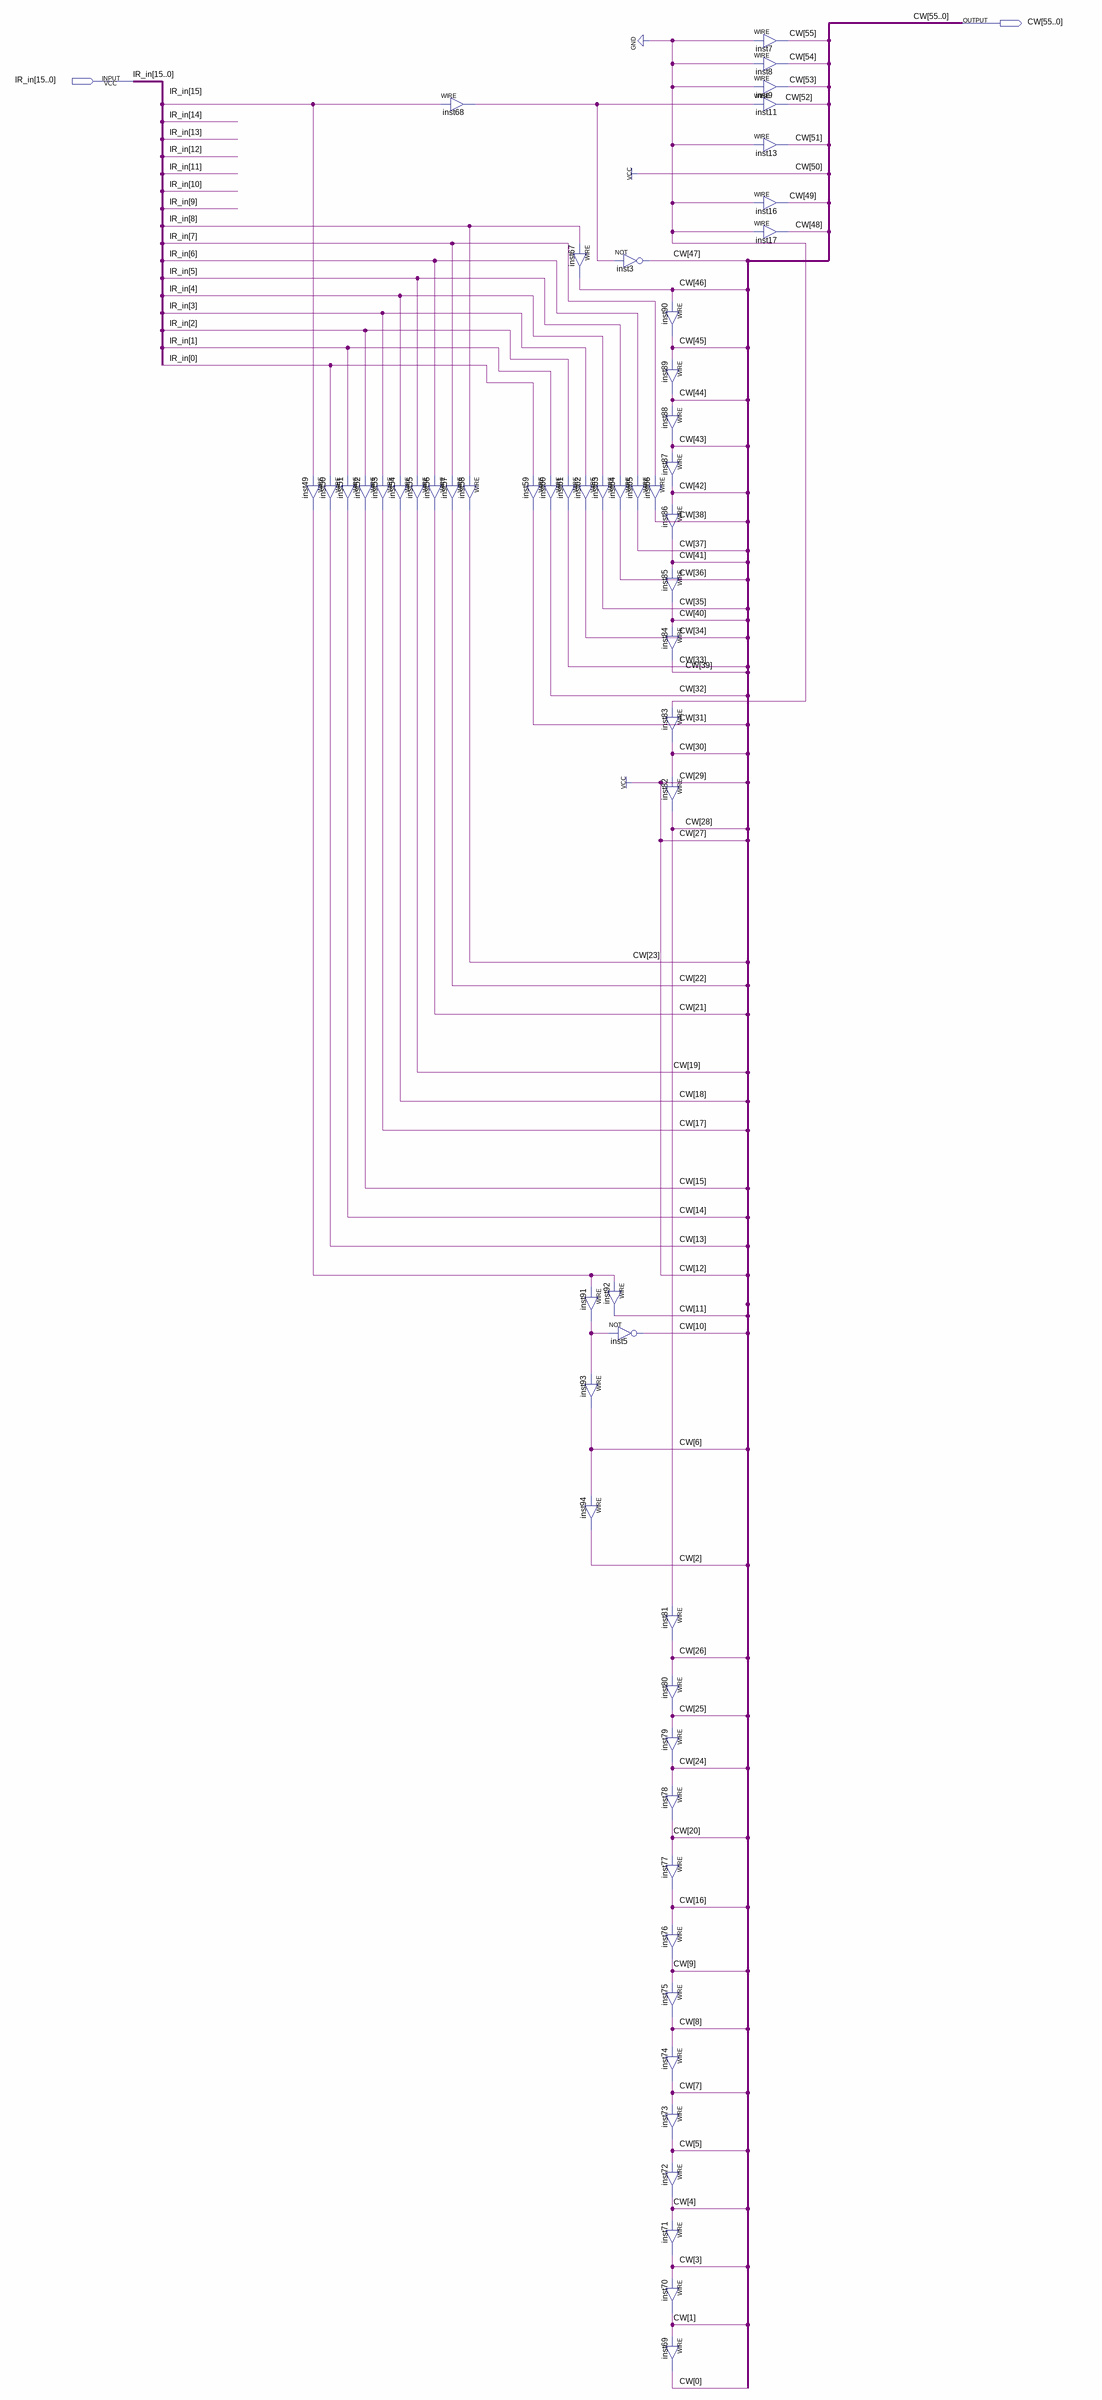
[diagram p0: schematic sheet]
// Quartus schematic Execute1.bdf as structural Verilog: 55 symbols, 2 pins
module Execute1 (
  input  [15:0] IR_in,
  output [55:0] CW
);

  wire inst49_out, inst68_out, inst91_out;

  assign inst49_out = IR_in[15];  // WIRE inst49
  assign CW[13] = IR_in[0];  // WIRE inst50
  assign CW[14] = IR_in[1];  // WIRE inst51
  assign CW[15] = IR_in[2];  // WIRE inst52
  assign CW[17] = IR_in[3];  // WIRE inst53
  assign CW[18] = IR_in[4];  // WIRE inst54
  assign CW[19] = IR_in[5];  // WIRE inst55
  assign inst68_out = IR_in[15];  // WIRE inst68
  assign CW[21] = IR_in[6];  // WIRE inst56
  assign CW[22] = IR_in[7];  // WIRE inst57
  assign CW[23] = IR_in[8];  // WIRE inst58
  assign CW[31] = IR_in[0];  // WIRE inst59
  assign CW[32] = IR_in[1];  // WIRE inst60
  assign CW[46] = IR_in[8];  // WIRE inst67
  assign CW[33] = IR_in[2];  // WIRE inst61
  assign CW[34] = IR_in[3];  // WIRE inst62
  assign CW[35] = IR_in[4];  // WIRE inst63
  assign inst91_out = inst49_out;  // WIRE inst91
  assign CW[6] = inst91_out;  // WIRE inst93
  assign CW[2] = CW[6];  // WIRE inst94
  not inst3 (CW[47], inst68_out);
  assign CW[36] = IR_in[5];  // WIRE inst64
  assign CW[37] = IR_in[6];  // WIRE inst65
  assign CW[11] = inst49_out;  // WIRE inst92
  not inst5 (CW[10], inst91_out);
  assign CW[45] = CW[46];  // WIRE inst90
  assign CW[44] = CW[45];  // WIRE inst89
  assign CW[43] = CW[44];  // WIRE inst88
  assign CW[42] = CW[43];  // WIRE inst87
  assign CW[38] = IR_in[7];  // WIRE inst66
  assign CW[41] = CW[42];  // WIRE inst86
  assign CW[40] = CW[41];  // WIRE inst85
  assign CW[39] = CW[40];  // WIRE inst84
  assign CW[30] = 1'b0;  // WIRE inst83
  assign CW[28] = CW[30];  // WIRE inst82
  assign CW[26] = CW[28];  // WIRE inst81
  assign CW[25] = CW[26];  // WIRE inst80
  assign CW[24] = CW[25];  // WIRE inst79
  assign CW[20] = CW[24];  // WIRE inst78
  assign CW[16] = CW[20];  // WIRE inst77
  assign CW[9] = CW[16];  // WIRE inst76
  assign CW[8] = CW[9];  // WIRE inst75
  assign CW[7] = CW[8];  // WIRE inst74
  assign CW[5] = CW[7];  // WIRE inst73
  assign CW[4] = CW[5];  // WIRE inst72
  assign CW[3] = CW[4];  // WIRE inst71
  assign CW[1] = CW[3];  // WIRE inst70
  assign CW[0] = CW[1];  // WIRE inst69
  assign CW[55] = 1'b0;  // WIRE inst7
  assign CW[54] = 1'b0;  // WIRE inst8
  assign CW[53] = 1'b0;  // WIRE inst9
  assign CW[52] = inst68_out;  // WIRE inst11
  assign CW[51] = 1'b0;  // WIRE inst13
  assign CW[49] = 1'b0;  // WIRE inst16
  assign CW[48] = 1'b0;  // WIRE inst17

  assign {CW[50], CW[29], CW[27], CW[12]} = 4'b1111;
endmodule
